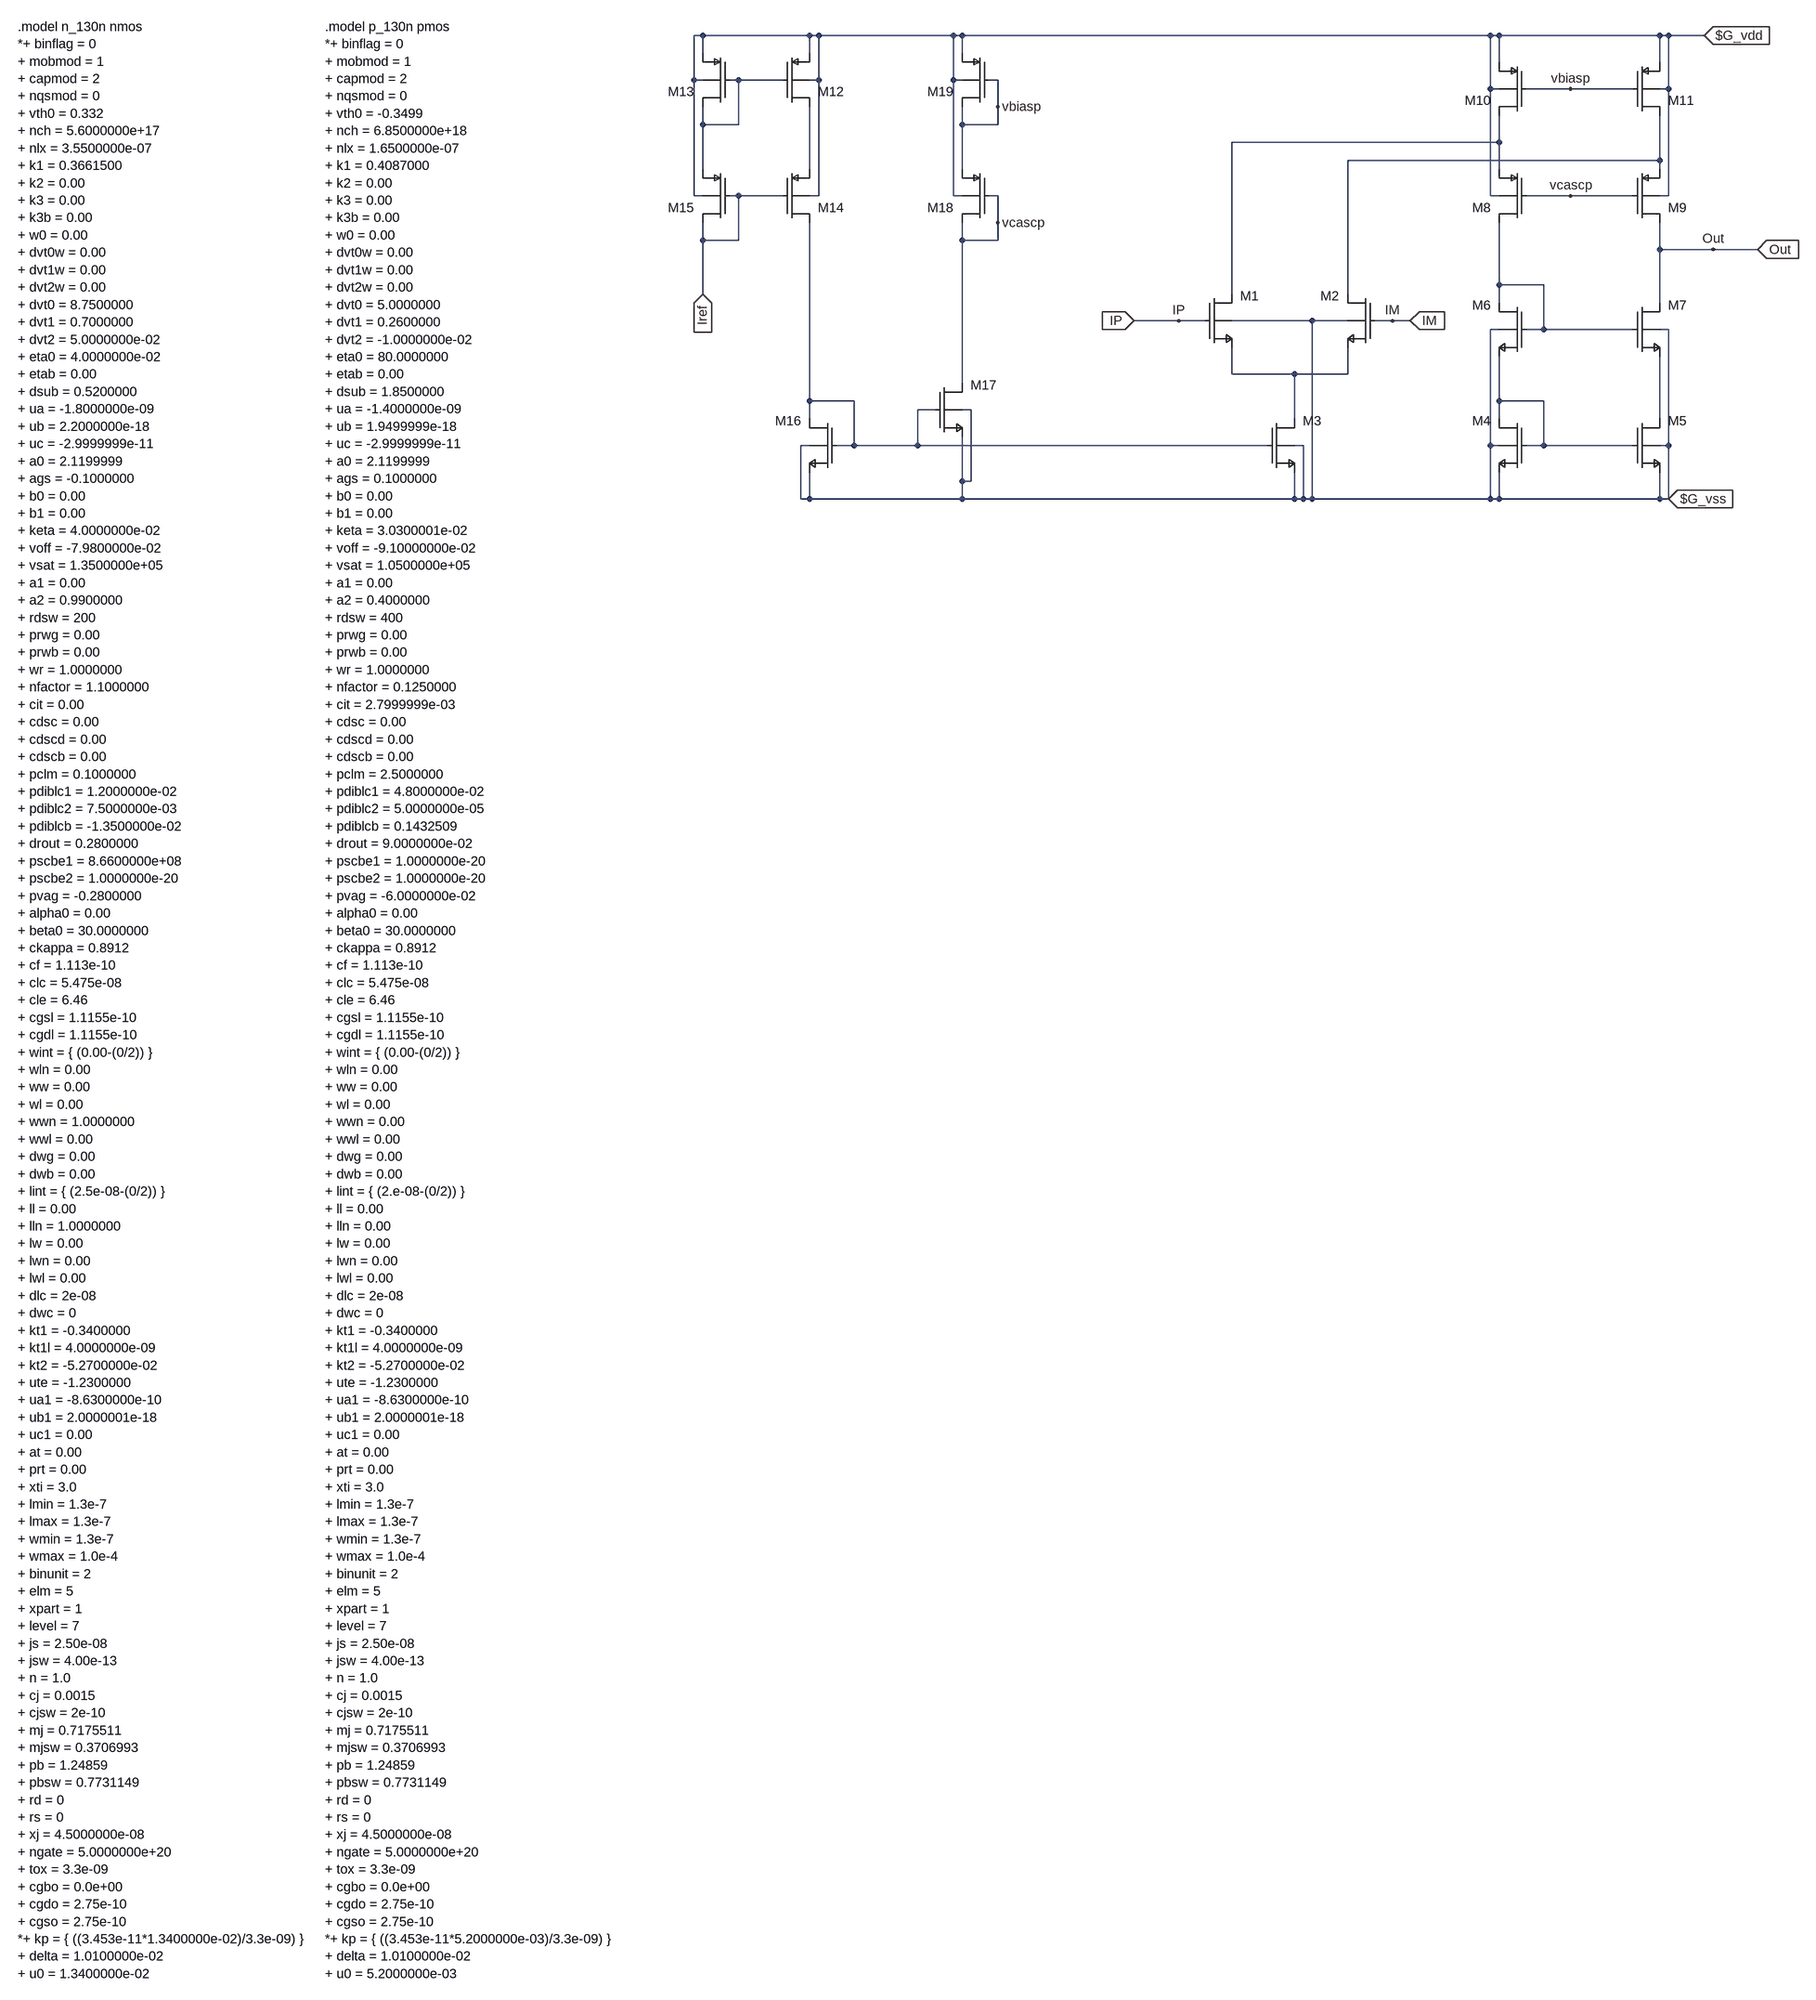
[diagram p0: schematic nmosFoldedCascode_ekvModellingEdited.asc]
nmosFoldedCascode_ekvModellingEdited.asc, the LTspice schematic file:
Version 4
SHEET 1 2836 2688
WIRE -208 -448 -224 -448
WIRE -16 -448 -208 -448
WIRE 0 -448 -16 -448
WIRE 400 -448 0 -448
WIRE 416 -448 400 -448
WIRE 1488 -448 416 -448
WIRE 1504 -448 1488 -448
WIRE 1792 -448 1504 -448
WIRE 1808 -448 1792 -448
WIRE 1872 -448 1808 -448
WIRE -208 -416 -208 -448
WIRE -16 -416 -16 -448
WIRE 416 -416 416 -448
WIRE 1504 -400 1504 -448
WIRE 1792 -400 1792 -448
WIRE -224 -368 -224 -448
WIRE -208 -368 -224 -368
WIRE -144 -368 -160 -368
WIRE -64 -368 -144 -368
WIRE 0 -368 0 -448
WIRE 0 -368 -16 -368
WIRE 400 -368 400 -448
WIRE 416 -368 400 -368
WIRE 480 -368 464 -368
WIRE 1488 -352 1488 -448
WIRE 1504 -352 1488 -352
WIRE 1632 -352 1552 -352
WIRE 1744 -352 1632 -352
WIRE 1808 -352 1808 -448
WIRE 1808 -352 1792 -352
WIRE 480 -320 480 -368
WIRE -208 -288 -208 -320
WIRE -144 -288 -144 -368
WIRE -144 -288 -208 -288
WIRE 416 -288 416 -320
WIRE 480 -288 480 -320
WIRE 480 -288 416 -288
WIRE 1504 -256 1504 -304
WIRE 1504 -256 1024 -256
WIRE 1792 -224 1792 -304
WIRE 1792 -224 1232 -224
WIRE -208 -208 -208 -288
WIRE -16 -208 -16 -320
WIRE 416 -208 416 -288
WIRE 1504 -208 1504 -256
WIRE 1792 -208 1792 -224
WIRE -224 -160 -224 -368
WIRE -208 -160 -224 -160
WIRE -144 -160 -160 -160
WIRE -64 -160 -144 -160
WIRE 0 -160 0 -368
WIRE 0 -160 -16 -160
WIRE 400 -160 400 -368
WIRE 416 -160 400 -160
WIRE 480 -160 464 -160
WIRE 1488 -160 1488 -352
WIRE 1504 -160 1488 -160
WIRE 1632 -160 1552 -160
WIRE 1744 -160 1632 -160
WIRE 1808 -160 1808 -352
WIRE 1808 -160 1792 -160
WIRE 480 -112 480 -160
WIRE -208 -80 -208 -112
WIRE -144 -80 -144 -160
WIRE -144 -80 -208 -80
WIRE 416 -80 416 -112
WIRE 480 -80 480 -112
WIRE 480 -80 416 -80
WIRE 1792 -64 1792 -112
WIRE 1888 -64 1792 -64
WIRE 1968 -64 1888 -64
WIRE 1504 0 1504 -112
WIRE 1584 0 1504 0
WIRE -208 16 -208 -80
WIRE 1024 16 1024 -256
WIRE 1232 16 1232 -224
WIRE 1504 32 1504 0
WIRE 1792 32 1792 -64
WIRE 928 64 848 64
WIRE 976 64 928 64
WIRE 1168 64 1024 64
WIRE 1232 64 1168 64
WIRE 1312 64 1280 64
WIRE 1344 64 1312 64
WIRE 1504 80 1488 80
WIRE 1584 80 1584 0
WIRE 1584 80 1552 80
WIRE 1744 80 1584 80
WIRE 1808 80 1792 80
WIRE 1024 160 1024 112
WIRE 1136 160 1024 160
WIRE 1232 160 1232 112
WIRE 1232 160 1136 160
WIRE 416 176 416 -80
WIRE -16 208 -16 -112
WIRE 64 208 -16 208
WIRE 1504 208 1504 128
WIRE 1584 208 1504 208
WIRE 368 224 336 224
WIRE 432 224 416 224
WIRE -16 240 -16 208
WIRE 1136 240 1136 160
WIRE 1504 240 1504 208
WIRE 1792 240 1792 128
WIRE -16 288 -32 288
WIRE 64 288 64 208
WIRE 64 288 32 288
WIRE 336 288 336 224
WIRE 336 288 64 288
WIRE 1088 288 336 288
WIRE 1152 288 1136 288
WIRE 1488 288 1488 80
WIRE 1504 288 1488 288
WIRE 1584 288 1584 208
WIRE 1584 288 1552 288
WIRE 1744 288 1584 288
WIRE 1808 288 1808 80
WIRE 1808 288 1792 288
WIRE 416 352 416 272
WIRE 432 352 432 224
WIRE 432 352 416 352
WIRE -32 384 -32 288
WIRE -16 384 -16 336
WIRE -16 384 -32 384
WIRE 416 384 416 352
WIRE 416 384 -16 384
WIRE 1136 384 1136 336
WIRE 1136 384 416 384
WIRE 1152 384 1152 288
WIRE 1152 384 1136 384
WIRE 1168 384 1168 64
WIRE 1168 384 1152 384
WIRE 1488 384 1488 288
WIRE 1488 384 1168 384
WIRE 1504 384 1504 336
WIRE 1504 384 1488 384
WIRE 1792 384 1792 336
WIRE 1792 384 1504 384
WIRE 1808 384 1808 288
WIRE 1808 384 1792 384
FLAG 928 64 IP
FLAG 1888 -64 Out
FLAG 1312 64 IM
FLAG 1632 -160 vcascp
FLAG 480 -112 vcascp
FLAG 480 -320 vbiasp
FLAG 1632 -352 vbiasp
FLAG 848 64 IP
IOPIN 848 64 In
FLAG 1344 64 IM
IOPIN 1344 64 In
FLAG 1808 384 $G_vss
IOPIN 1808 384 In
FLAG 1968 -64 Out
IOPIN 1968 -64 In
FLAG 1872 -448 $G_vdd
IOPIN 1872 -448 In
FLAG -208 16 Iref
IOPIN -208 16 In
SYMBOL nmosb 976 16 R0
WINDOW 3 63 27 Invisible 2
SYMATTR Value n_130n l=130.0n w=28.149u ad=5.63p as=5.63p pd=56.698u ps=56.698u m=1
SYMATTR InstName M1
SYMBOL pmosb 1552 -208 M0
WINDOW 3 63 27 Invisible 2
SYMATTR Value p_130n l=130.0n w=2.401u ad=480.151f as=480.151f pd=5.202u ps=5.202u m=1
SYMATTR InstName M8
SYMBOL nmosb 1280 16 M0
WINDOW 3 63 27 Invisible 2
SYMATTR Value n_130n l=130.0n w=28.149u ad=5.63p as=5.63p pd=56.698u ps=56.698u m=1
SYMATTR InstName M2
SYMBOL nmosb 1088 240 R0
WINDOW 3 63 27 Invisible 2
SYMATTR Value n_130n l=3.0u w=51.967u ad=10.393p as=10.393p pd=104.335u ps=104.335u m=1
SYMATTR InstName M3
SYMBOL nmosb 1552 240 M0
WINDOW 3 63 27 Invisible 2
SYMATTR Value n_130n l=1.0u w=20.787u ad=4.157p as=4.157p pd=41.974u ps=41.974u m=1
SYMATTR InstName M4
SYMBOL nmosb 1744 240 R0
WINDOW 3 63 27 Invisible 2
SYMATTR Value n_130n l=1.0u w=20.787u ad=4.157p as=4.157p pd=41.974u ps=41.974u m=1
SYMATTR InstName M5
SYMBOL nmosb 1552 32 M0
WINDOW 3 63 27 Invisible 2
SYMATTR Value n_130n l=130.0n w=3.153u ad=630.538f as=630.538f pd=6.705u ps=6.705u m=1
SYMATTR InstName M6
SYMBOL nmosb 1744 32 R0
WINDOW 3 63 27 Invisible 2
SYMATTR Value n_130n l=130.0n w=3.153u ad=630.538f as=630.538f pd=6.705u ps=6.705u m=1
SYMATTR InstName M7
SYMBOL pmosb 1744 -208 R0
WINDOW 3 63 27 Invisible 2
SYMATTR Value p_130n l=130.0n w=2.401u ad=480.151f as=480.151f pd=5.202u ps=5.202u m=1
SYMATTR InstName M9
SYMBOL pmosb 1552 -400 M0
WINDOW 3 63 27 Invisible 2
SYMATTR Value p_130n l=1.0u w=395.729u ad=79.146p as=79.146p pd=791.858u ps=791.858u m=1
SYMATTR InstName M10
SYMBOL pmosb 1744 -400 R0
WINDOW 3 63 27 Invisible 2
SYMATTR Value p_130n l=1.0u w=395.729u ad=79.146p as=79.146p pd=791.858u ps=791.858u m=1
SYMATTR InstName M11
SYMBOL pmosb -64 -416 R0
WINDOW 3 63 27 Invisible 2
SYMATTR Value p_130n l=3.0u w=6.631u ad=1.326p as=1.326p pd=13.663u ps=13.663u m=1
SYMATTR InstName M12
SYMBOL pmosb -160 -416 M0
WINDOW 3 63 27 Invisible 2
SYMATTR Value p_130n l=3.0u w=6.631u ad=1.326p as=1.326p pd=13.663u ps=13.663u m=1
SYMATTR InstName M13
SYMBOL pmosb -64 -208 R0
WINDOW 3 63 27 Invisible 2
SYMATTR Value p_130n l=3.0u w=6.631u ad=1.326p as=1.326p pd=13.663u ps=13.663u m=1
SYMATTR InstName M14
SYMBOL pmosb -160 -208 M0
WINDOW 3 63 27 Invisible 2
SYMATTR Value p_130n l=3.0u w=6.631u ad=1.326p as=1.326p pd=13.663u ps=13.663u m=1
SYMATTR InstName M15
SYMBOL nmosb 32 240 M0
WINDOW 3 63 27 Invisible 2
SYMATTR Value n_130n l=3.0u w=4.354u ad=870.827f as=870.827f pd=9.108u ps=9.108u m=1
SYMATTR InstName M16
SYMBOL nmosb 368 176 R0
WINDOW 3 63 27 Invisible 2
SYMATTR Value n_130n l=3.0u w=870.827n ad=174.165f as=174.165f pd=2.142u ps=2.142u m=1
SYMATTR InstName M17
SYMBOL pmosb 464 -416 M0
WINDOW 3 63 27 Invisible 2
SYMATTR Value p_130n l=1.0u w=5.526u ad=1.105p as=1.105p pd=11.452u ps=11.452u m=1
SYMATTR InstName M19
SYMBOL pmosb 464 -208 M0
WINDOW 3 63 27 Invisible 2
SYMATTR Value p_130n l=500.0n w=4.0u ad=800.0f as=800.0f pd=8.4u ps=8.4u m=1
SYMATTR InstName M18
TEXT -1528 -464 Left 2 !.model n_130n nmos \n*+ binflag = 0 \n+ mobmod = 1 \n+ capmod = 2 \n+ nqsmod = 0 \n+ vth0 = 0.332 \n+ nch = 5.6000000e+17 \n+ nlx = 3.5500000e-07 \n+ k1 = 0.3661500 \n+ k2 = 0.00 \n+ k3 = 0.00 \n+ k3b = 0.00 \n+ w0 = 0.00 \n+ dvt0w = 0.00 \n+ dvt1w = 0.00 \n+ dvt2w = 0.00 \n+ dvt0 = 8.7500000 \n+ dvt1 = 0.7000000 \n+ dvt2 = 5.0000000e-02 \n+ eta0 = 4.0000000e-02 \n+ etab = 0.00 \n+ dsub = 0.5200000 \n+ ua = -1.8000000e-09 \n+ ub = 2.2000000e-18 \n+ uc = -2.9999999e-11 \n+ a0 = 2.1199999 \n+ ags = -0.1000000 \n+ b0 = 0.00 \n+ b1 = 0.00 \n+ keta = 4.0000000e-02 \n+ voff = -7.9800000e-02 \n+ vsat = 1.3500000e+05 \n+ a1 = 0.00 \n+ a2 = 0.9900000 \n+ rdsw = 200 \n+ prwg = 0.00 \n+ prwb = 0.00 \n+ wr = 1.0000000 \n+ nfactor = 1.1000000 \n+ cit = 0.00 \n+ cdsc = 0.00 \n+ cdscd = 0.00 \n+ cdscb = 0.00 \n+ pclm = 0.1000000 \n+ pdiblc1 = 1.2000000e-02 \n+ pdiblc2 = 7.5000000e-03 \n+ pdiblcb = -1.3500000e-02 \n+ drout = 0.2800000 \n+ pscbe1 = 8.6600000e+08 \n+ pscbe2 = 1.0000000e-20 \n+ pvag = -0.2800000 \n+ alpha0 = 0.00 \n+ beta0 = 30.0000000 \n+ ckappa = 0.8912 \n+ cf = 1.113e-10 \n+ clc = 5.475e-08 \n+ cle = 6.46 \n+ cgsl = 1.1155e-10 \n+ cgdl = 1.1155e-10 \n+ wint = { (0.00-(0/2)) } \n+ wln = 0.00 \n+ ww = 0.00 \n+ wl = 0.00 \n+ wwn = 1.0000000 \n+ wwl = 0.00 \n+ dwg = 0.00 \n+ dwb = 0.00 \n+ lint = { (2.5e-08-(0/2)) } \n+ ll = 0.00 \n+ lln = 1.0000000 \n+ lw = 0.00 \n+ lwn = 0.00 \n+ lwl = 0.00 \n+ dlc = 2e-08 \n+ dwc = 0 \n+ kt1 = -0.3400000 \n+ kt1l = 4.0000000e-09 \n+ kt2 = -5.2700000e-02 \n+ ute = -1.2300000 \n+ ua1 = -8.6300000e-10 \n+ ub1 = 2.0000001e-18 \n+ uc1 = 0.00 \n+ at = 0.00 \n+ prt = 0.00 \n+ xti = 3.0 \n+ lmin = 1.3e-7 \n+ lmax = 1.3e-7 \n+ wmin = 1.3e-7 \n+ wmax = 1.0e-4 \n+ binunit = 2 \n+ elm = 5\n+ xpart = 1 \n+ level = 7 \n+ js = 2.50e-08 \n+ jsw = 4.00e-13 \n+ n = 1.0 \n+ cj = 0.0015 \n+ cjsw = 2e-10 \n+ mj = 0.7175511 \n+ mjsw = 0.3706993 \n+ pb = 1.24859 \n+ pbsw = 0.7731149 \n+ rd = 0 \n+ rs = 0 \n+ xj = 4.5000000e-08 \n+ ngate = 5.0000000e+20 \n+ tox = 3.3e-09 \n+ cgbo = 0.0e+00 \n+ cgdo = 2.75e-10 \n+ cgso = 2.75e-10 \n*+ kp = { ((3.453e-11*1.3400000e-02)/3.3e-09) } \n+ delta = 1.0100000e-02 \n+ u0 = 1.3400000e-02
TEXT -976 -464 Left 2 !.model p_130n pmos \n*+ binflag = 0 \n+ mobmod = 1 \n+ capmod = 2 \n+ nqsmod = 0 \n+ vth0 = -0.3499 \n+ nch = 6.8500000e+18 \n+ nlx = 1.6500000e-07 \n+ k1 = 0.4087000 \n+ k2 = 0.00 \n+ k3 = 0.00 \n+ k3b = 0.00 \n+ w0 = 0.00 \n+ dvt0w = 0.00 \n+ dvt1w = 0.00 \n+ dvt2w = 0.00 \n+ dvt0 = 5.0000000 \n+ dvt1 = 0.2600000 \n+ dvt2 = -1.0000000e-02 \n+ eta0 = 80.0000000 \n+ etab = 0.00 \n+ dsub = 1.8500000 \n+ ua = -1.4000000e-09 \n+ ub = 1.9499999e-18 \n+ uc = -2.9999999e-11 \n+ a0 = 2.1199999 \n+ ags = 0.1000000 \n+ b0 = 0.00 \n+ b1 = 0.00 \n+ keta = 3.0300001e-02 \n+ voff = -9.10000000e-02 \n+ vsat = 1.0500000e+05 \n+ a1 = 0.00 \n+ a2 = 0.4000000 \n+ rdsw = 400 \n+ prwg = 0.00 \n+ prwb = 0.00 \n+ wr = 1.0000000 \n+ nfactor = 0.1250000 \n+ cit = 2.7999999e-03 \n+ cdsc = 0.00 \n+ cdscd = 0.00 \n+ cdscb = 0.00 \n+ pclm = 2.5000000 \n+ pdiblc1 = 4.8000000e-02 \n+ pdiblc2 = 5.0000000e-05 \n+ pdiblcb = 0.1432509 \n+ drout = 9.0000000e-02 \n+ pscbe1 = 1.0000000e-20 \n+ pscbe2 = 1.0000000e-20 \n+ pvag = -6.0000000e-02 \n+ alpha0 = 0.00 \n+ beta0 = 30.0000000 \n+ ckappa = 0.8912 \n+ cf = 1.113e-10 \n+ clc = 5.475e-08 \n+ cle = 6.46 \n+ cgsl = 1.1155e-10 \n+ cgdl = 1.1155e-10 \n+ wint = { (0.00-(0/2)) } \n+ wln = 0.00 \n+ ww = 0.00 \n+ wl = 0.00 \n+ wwn = 0.00 \n+ wwl = 0.00 \n+ dwg = 0.00 \n+ dwb = 0.00 \n+ lint = { (2.e-08-(0/2)) } \n+ ll = 0.00 \n+ lln = 0.00 \n+ lw = 0.00 \n+ lwn = 0.00 \n+ lwl = 0.00 \n+ dlc = 2e-08 \n+ dwc = 0 \n+ kt1 = -0.3400000 \n+ kt1l = 4.0000000e-09 \n+ kt2 = -5.2700000e-02 \n+ ute = -1.2300000 \n+ ua1 = -8.6300000e-10 \n+ ub1 = 2.0000001e-18 \n+ uc1 = 0.00 \n+ at = 0.00 \n+ prt = 0.00 \n+ xti = 3.0 \n+ lmin = 1.3e-7 \n+ lmax = 1.3e-7 \n+ wmin = 1.3e-7 \n+ wmax = 1.0e-4 \n+ binunit = 2 \n+ elm = 5 \n+ xpart = 1 \n+ level = 7 \n+ js = 2.50e-08 \n+ jsw = 4.00e-13 \n+ n = 1.0 \n+ cj = 0.0015 \n+ cjsw = 2e-10 \n+ mj = 0.7175511 \n+ mjsw = 0.3706993 \n+ pb = 1.24859 \n+ pbsw = 0.7731149 \n+ rd = 0 \n+ rs = 0 \n+ xj = 4.5000000e-08 \n+ ngate = 5.0000000e+20 \n+ tox = 3.3e-09 \n+ cgbo = 0.0e+00 \n+ cgdo = 2.75e-10 \n+ cgso = 2.75e-10 \n*+ kp = { ((3.453e-11*5.2000000e-03)/3.3e-09) } \n+ delta = 1.0100000e-02 \n+ u0 = 5.2000000e-03

The netlist it stands for:
* nmosFoldedCascode_ekvModellingEdited.asc
M1 N002 IP N006 $G_vss n_130n l=130.0n w=28.149u ad=5.63p as=5.63p pd=56.698u ps=56.698u m=1
M8 N005 vcascp N002 $G_vdd p_130n l=130.0n w=2.401u ad=480.151f as=480.151f pd=5.202u ps=5.202u m=1
M2 N003 IM N006 $G_vss n_130n l=130.0n w=28.149u ad=5.63p as=5.63p pd=56.698u ps=56.698u m=1
M3 N006 N007 $G_vss $G_vss n_130n l=3.0u w=51.967u ad=10.393p as=10.393p pd=104.335u ps=104.335u m=1
M4 N008 N008 $G_vss $G_vss n_130n l=1.0u w=20.787u ad=4.157p as=4.157p pd=41.974u ps=41.974u m=1
M5 N009 N008 $G_vss $G_vss n_130n l=1.0u w=20.787u ad=4.157p as=4.157p pd=41.974u ps=41.974u m=1
M6 N005 N005 N008 $G_vss n_130n l=130.0n w=3.153u ad=630.538f as=630.538f pd=6.705u ps=6.705u m=1
M7 Out N005 N009 $G_vss n_130n l=130.0n w=3.153u ad=630.538f as=630.538f pd=6.705u ps=6.705u m=1
M9 Out vcascp N003 $G_vdd p_130n l=130.0n w=2.401u ad=480.151f as=480.151f pd=5.202u ps=5.202u m=1
M10 N002 vbiasp $G_vdd $G_vdd p_130n l=1.0u w=395.729u ad=79.146p as=79.146p pd=791.858u ps=791.858u m=1
M11 N003 vbiasp $G_vdd $G_vdd p_130n l=1.0u w=395.729u ad=79.146p as=79.146p pd=791.858u ps=791.858u m=1
M12 N004 N001 $G_vdd $G_vdd p_130n l=3.0u w=6.631u ad=1.326p as=1.326p pd=13.663u ps=13.663u m=1
M13 N001 N001 $G_vdd $G_vdd p_130n l=3.0u w=6.631u ad=1.326p as=1.326p pd=13.663u ps=13.663u m=1
M14 N007 Iref N004 $G_vdd p_130n l=3.0u w=6.631u ad=1.326p as=1.326p pd=13.663u ps=13.663u m=1
M15 Iref Iref N001 $G_vdd p_130n l=3.0u w=6.631u ad=1.326p as=1.326p pd=13.663u ps=13.663u m=1
M16 N007 N007 $G_vss $G_vss n_130n l=3.0u w=4.354u ad=870.827f as=870.827f pd=9.108u ps=9.108u m=1
M17 vcascp N007 $G_vss $G_vss n_130n l=3.0u w=870.827n ad=174.165f as=174.165f pd=2.142u ps=2.142u m=1
M19 vbiasp vbiasp $G_vdd $G_vdd p_130n l=1.0u w=5.526u ad=1.105p as=1.105p pd=11.452u ps=11.452u m=1
M18 vcascp vcascp vbiasp $G_vdd p_130n l=500.0n w=4.0u ad=800.0f as=800.0f pd=8.4u ps=8.4u m=1
.model NMOS NMOS
.model PMOS PMOS
.lib standard.mos
.model n_130n nmos
*+ binflag = 0
+ mobmod = 1
+ capmod = 2
+ nqsmod = 0
+ vth0 = 0.332
+ nch = 5.6000000e+17
+ nlx = 3.5500000e-07
+ k1 = 0.3661500
+ k2 = 0.00
+ k3 = 0.00
+ k3b = 0.00
+ w0 = 0.00
+ dvt0w = 0.00
+ dvt1w = 0.00
+ dvt2w = 0.00
+ dvt0 = 8.7500000
+ dvt1 = 0.7000000
+ dvt2 = 5.0000000e-02
+ eta0 = 4.0000000e-02
+ etab = 0.00
+ dsub = 0.5200000
+ ua = -1.8000000e-09
+ ub = 2.2000000e-18
+ uc = -2.9999999e-11
+ a0 = 2.1199999
+ ags = -0.1000000
+ b0 = 0.00
+ b1 = 0.00
+ keta = 4.0000000e-02
+ voff = -7.9800000e-02
+ vsat = 1.3500000e+05
+ a1 = 0.00
+ a2 = 0.9900000
+ rdsw = 200
+ prwg = 0.00
+ prwb = 0.00
+ wr = 1.0000000
+ nfactor = 1.1000000
+ cit = 0.00
+ cdsc = 0.00
+ cdscd = 0.00
+ cdscb = 0.00
+ pclm = 0.1000000
+ pdiblc1 = 1.2000000e-02
+ pdiblc2 = 7.5000000e-03
+ pdiblcb = -1.3500000e-02
+ drout = 0.2800000
+ pscbe1 = 8.6600000e+08
+ pscbe2 = 1.0000000e-20
+ pvag = -0.2800000
+ alpha0 = 0.00
+ beta0 = 30.0000000
+ ckappa = 0.8912
+ cf = 1.113e-10
+ clc = 5.475e-08
+ cle = 6.46
+ cgsl = 1.1155e-10
+ cgdl = 1.1155e-10
+ wint = { (0.00-(0/2)) }
+ wln = 0.00
+ ww = 0.00
+ wl = 0.00
+ wwn = 1.0000000
+ wwl = 0.00
+ dwg = 0.00
+ dwb = 0.00
+ lint = { (2.5e-08-(0/2)) }
+ ll = 0.00
+ lln = 1.0000000
+ lw = 0.00
+ lwn = 0.00
+ lwl = 0.00
+ dlc = 2e-08
+ dwc = 0
+ kt1 = -0.3400000
+ kt1l = 4.0000000e-09
+ kt2 = -5.2700000e-02
+ ute = -1.2300000
+ ua1 = -8.6300000e-10
+ ub1 = 2.0000001e-18
+ uc1 = 0.00
+ at = 0.00
+ prt = 0.00
+ xti = 3.0
+ lmin = 1.3e-7
+ lmax = 1.3e-7
+ wmin = 1.3e-7
+ wmax = 1.0e-4
+ binunit = 2
+ elm = 5
+ xpart = 1
+ level = 7
+ js = 2.50e-08
+ jsw = 4.00e-13
+ n = 1.0
+ cj = 0.0015
+ cjsw = 2e-10
+ mj = 0.7175511
+ mjsw = 0.3706993
+ pb = 1.24859
+ pbsw = 0.7731149
+ rd = 0
+ rs = 0
+ xj = 4.5000000e-08
+ ngate = 5.0000000e+20
+ tox = 3.3e-09
+ cgbo = 0.0e+00
+ cgdo = 2.75e-10
+ cgso = 2.75e-10
*+ kp = { ((3.453e-11*1.3400000e-02)/3.3e-09) }
+ delta = 1.0100000e-02
+ u0 = 1.3400000e-02
.model p_130n pmos
*+ binflag = 0
+ mobmod = 1
+ capmod = 2
+ nqsmod = 0
+ vth0 = -0.3499
+ nch = 6.8500000e+18
+ nlx = 1.6500000e-07
+ k1 = 0.4087000
+ k2 = 0.00
+ k3 = 0.00
+ k3b = 0.00
+ w0 = 0.00
+ dvt0w = 0.00
+ dvt1w = 0.00
+ dvt2w = 0.00
+ dvt0 = 5.0000000
+ dvt1 = 0.2600000
+ dvt2 = -1.0000000e-02
+ eta0 = 80.0000000
+ etab = 0.00
+ dsub = 1.8500000
+ ua = -1.4000000e-09
+ ub = 1.9499999e-18
+ uc = -2.9999999e-11
+ a0 = 2.1199999
+ ags = 0.1000000
+ b0 = 0.00
+ b1 = 0.00
+ keta = 3.0300001e-02
+ voff = -9.10000000e-02
+ vsat = 1.0500000e+05
+ a1 = 0.00
+ a2 = 0.4000000
+ rdsw = 400
+ prwg = 0.00
+ prwb = 0.00
+ wr = 1.0000000
+ nfactor = 0.1250000
+ cit = 2.7999999e-03
+ cdsc = 0.00
+ cdscd = 0.00
+ cdscb = 0.00
+ pclm = 2.5000000
+ pdiblc1 = 4.8000000e-02
+ pdiblc2 = 5.0000000e-05
+ pdiblcb = 0.1432509
+ drout = 9.0000000e-02
+ pscbe1 = 1.0000000e-20
+ pscbe2 = 1.0000000e-20
+ pvag = -6.0000000e-02
+ alpha0 = 0.00
+ beta0 = 30.0000000
+ ckappa = 0.8912
+ cf = 1.113e-10
+ clc = 5.475e-08
+ cle = 6.46
+ cgsl = 1.1155e-10
+ cgdl = 1.1155e-10
+ wint = { (0.00-(0/2)) }
+ wln = 0.00
+ ww = 0.00
+ wl = 0.00
+ wwn = 0.00
+ wwl = 0.00
+ dwg = 0.00
+ dwb = 0.00
+ lint = { (2.e-08-(0/2)) }
+ ll = 0.00
+ lln = 0.00
+ lw = 0.00
+ lwn = 0.00
+ lwl = 0.00
+ dlc = 2e-08
+ dwc = 0
+ kt1 = -0.3400000
+ kt1l = 4.0000000e-09
+ kt2 = -5.2700000e-02
+ ute = -1.2300000
+ ua1 = -8.6300000e-10
+ ub1 = 2.0000001e-18
+ uc1 = 0.00
+ at = 0.00
+ prt = 0.00
+ xti = 3.0
+ lmin = 1.3e-7
+ lmax = 1.3e-7
+ wmin = 1.3e-7
+ wmax = 1.0e-4
+ binunit = 2
+ elm = 5
+ xpart = 1
+ level = 7
+ js = 2.50e-08
+ jsw = 4.00e-13
+ n = 1.0
+ cj = 0.0015
+ cjsw = 2e-10
+ mj = 0.7175511
+ mjsw = 0.3706993
+ pb = 1.24859
+ pbsw = 0.7731149
+ rd = 0
+ rs = 0
+ xj = 4.5000000e-08
+ ngate = 5.0000000e+20
+ tox = 3.3e-09
+ cgbo = 0.0e+00
+ cgdo = 2.75e-10
+ cgso = 2.75e-10
*+ kp = { ((3.453e-11*5.2000000e-03)/3.3e-09) }
+ delta = 1.0100000e-02
+ u0 = 5.2000000e-03
.backanno
.end